# EAGLE design mainboard (EAGLE 9.6.2)
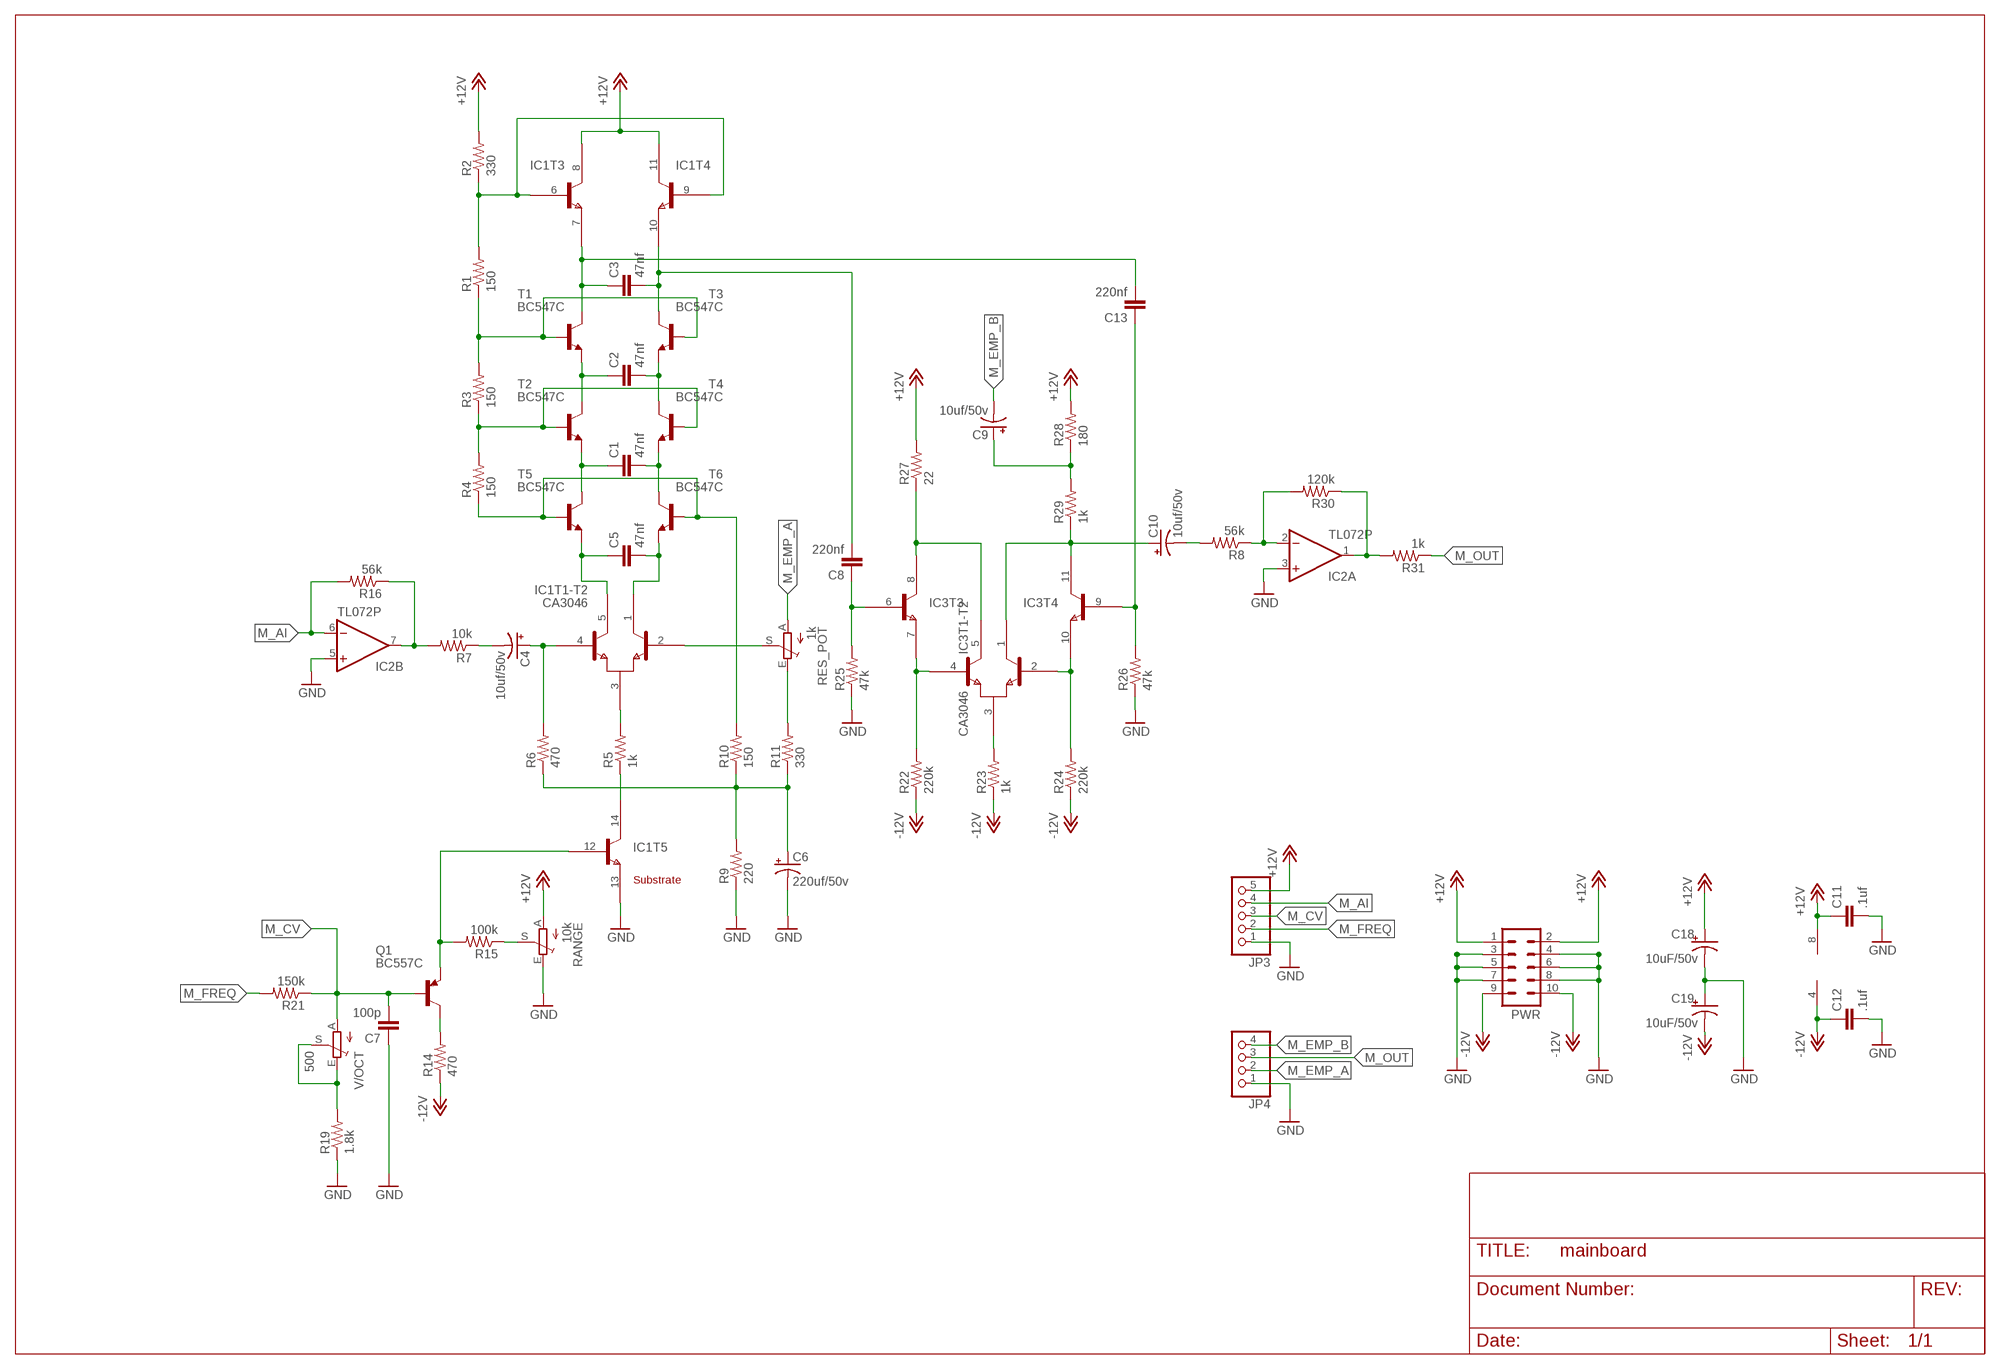
[diagram p0: schematic, sheet 1]

## Parts
C1  47nf  C-EU050-024X044  [C050-024X044]
C2  47nf  C-EU050-024X044  [C050-024X044]
C3  47nf  C-EU050-024X044  [C050-024X044]
C4  10uf/50v  CPOL-USE2.5-5  [E2,5-5]
C5  47nf  C-EU050-024X044  [C050-024X044]
C6  220uf/50v  CPOL-USE3.5-10  [E3,5-10]
C7  100p  C-EU050-024X044  [C050-024X044]
C8  220nf  C-EU050-024X044  [C050-024X044]
C9  10uf/50v  CPOL-USE2.5-5  [E2,5-5]
C10  10uf/50v  CPOL-USE2.5-5  [E2,5-5]
C11  .1uf  C-EU050-024X044  [C050-024X044]
C12  .1uf  C-EU050-024X044  [C050-024X044]
C13  220nf  C-EU050-024X044  [C050-024X044]
C18  10uF/50v  CPOL-USE2.5-6  [E2,5-6]
C19  10uF/50v  CPOL-USE2.5-6  [E2,5-6]
IC1  CA3046  [DIL14]
IC2  TL072P  [DIL08]
IC3  CA3046  [DIL14]
JP3  PINHD-1X5  [1X05]
JP4  PINHD-1X4  [1X04]
PWR  ML10  [ML10]
Q1  BC557C  [TO92-EBC]
R1  150  R-US_0204/7  [0204/7]
R2  330  R-US_0204/7  [0204/7]
R3  150  R-US_0204/7  [0204/7]
R4  150  R-US_0204/7  [0204/7]
R5  1k  R-US_0204/7  [0204/7]
R6  470  R-US_0204/7  [0204/7]
R7  10k  R-US_0204/7  [0204/7]
R8  56k  R-US_0204/7  [0204/7]
R9  220  R-US_0204/7  [0204/7]
R10  150  R-US_0204/7  [0204/7]
R11  330  R-US_0204/7  [0204/7]
R14  470  R-US_0204/7  [0204/7]
R15  100k  R-US_0204/7  [0204/7]
R16  56k  R-US_0204/7  [0204/7]
R19  1.8k  R-US_0204/7  [0204/7]
R21  150k  R-US_0204/7  [0204/7]
R22  220k  R-US_0204/7  [0204/7]
R23  1k  R-US_0204/7  [0204/7]
R24  220k  R-US_0204/7  [0204/7]
R25  47k  R-US_0204/7  [0204/7]
R26  47k  R-US_0204/7  [0204/7]
R27  22  R-US_0204/7  [0204/7]
R28  180  R-US_0204/7  [0204/7]
R29  1k  R-US_0204/7  [0204/7]
R30  120k  R-US_0204/7  [0204/7]
R31  1k  R-US_0204/7  [0204/7]
RANGE  10k  TRIM_EU-CA9V  [CA9V]
RES_POT  1k  TRIM_EU-CA9V  [CA9V]
T1  BC547C  BC547-NPN-TO92-CBE  [TO92-CBE]
T2  BC547C  BC547-NPN-TO92-CBE  [TO92-CBE]
T3  BC547C  BC547-NPN-TO92-CBE  [TO92-CBE]
T4  BC547C  BC547-NPN-TO92-CBE  [TO92-CBE]
T5  BC547C  BC547-NPN-TO92-CBE  [TO92-CBE]
T6  BC547C  BC547-NPN-TO92-CBE  [TO92-CBE]
V/OCT  500  TRIM_1234-S64YW  [S64YW]

## Nets
+12V: C11.1 C18.+ IC1.8(T3:C) IC1.11(T4:C) IC2.8(P:V+) JP3.5 PWR.1 PWR.2 R2.2 R27.2 R28.2 RANGE.A
-12V: C12.1 C19.- IC2.4(P:V-) PWR.9 PWR.10 R14.1 R22.1 R23.1 R24.1
GND: C6.- C7.1 C11.2 C12.2 C18.- C19.+ IC1.13(T5:E) IC2.3(A:+IN) IC2.5(B:+IN) JP3.1 JP4.1 PWR.3 PWR.4 PWR.5 PWR.6 PWR.7 PWR.8 R9.1 R19.1 R25.1 R26.1 RANGE.E
M_AI: IC2.6(B:-IN) JP3.4 R16.2
M_CV: C7.2 JP3.3 Q1.B R21.1 V/OCT.A
M_EMP_A: JP4.2 RES_POT.A
M_EMP_B: C9.- JP4.4
M_FREQ: JP3.2 R21.2
M_OUT: JP4.3 R31.1
N$1: C5.1 IC1.5(T1-T2:C2) T5.E
N$2: IC1.6(T3:B) IC1.9(T4:B) R1.2 R2.1
N$3: C3.1 C13.2 IC1.7(T3:E) T1.C
N$4: C3.2 C8.2 IC1.10(T4:E) T3.C
N$5: C2.1 T1.E T2.C
N$6: C2.2 T3.E T4.C
N$7: C1.1 T2.E T5.C
N$8: C1.2 T4.E T6.C
N$9: R1.1 R3.2 T1.B T3.B
N$10: R3.1 R4.2 T2.B T4.B
N$11: R4.1 R10.2 T5.B T6.B
N$12: C5.2 IC1.1(T1-T2:C1) T6.E
N$13: IC1.3(T1-T2:E) R5.2
N$14: IC1.14(T5:C) R5.1
N$15: C4.+ IC1.4(T1-T2:B2) R6.2
N$16: C4.- R7.1
N$17: C6.+ R6.1 R9.2 R10.1 R11.1
N$18: IC2.7(B:OUT) R7.2 R16.1
N$19: R19.2 V/OCT.E V/OCT.S
N$20: IC1.12(T5:B) Q1.E R15.2
N$21: IC1.2(T1-T2:B1) RES_POT.S
N$22: R11.2 RES_POT.E
N$23: C13.1 IC3.9(T4:B) R26.2
N$25: Q1.C R14.2
N$26: R15.1 RANGE.S
N$32: C10.- R8.2
N$34: IC3.4(T1-T2:B2) IC3.7(T3:E) R22.2
N$35: IC3.3(T1-T2:E) R23.2
N$36: IC3.2(T1-T2:B1) IC3.10(T4:E) R24.2
N$38: IC3.5(T1-T2:C2) IC3.8(T3:C) R27.1
N$39: C10.+ IC3.1(T1-T2:C1) IC3.11(T4:C) R29.1
N$40: C9.+ R28.1 R29.2
N$41: IC2.1(A:OUT) R30.1 R31.2
N$42: C8.1 IC3.6(T3:B) R25.2
N$43: IC2.2(A:-IN) R8.1 R30.2
Unconnected: IC3.12(T5:B) IC3.13(T5:E) IC3.14(T5:C) V/OCT.S@1(S)

## Library data of the parts
C1-C3 C5 C7 C8 C11-C13 = resistor:C-EU: CAPACITOR, European symbol
C4 C6 C9 C10 C18 C19 = resistor:CPOL-US: POLARIZED CAPACITOR, American symbol
IC1 IC3 = synthdiy:CA3046: NPN Transistor Array
IC2 = TomW:TL072: OP AMP
JP3 = pinhead:PINHD-1X5: PIN HEADER
JP4 = pinhead:PINHD-1X4: PIN HEADER
PWR = con-ml:ML10: HARTING; OC_FARNELL: unknown; OC_NEWARK: unknown
Q1 = transistor-pnp:BC557*: PNP Transistror
R1-R11 R14-R16 R19 R21-R31 = resistor:R-US_: RESISTOR, American symbol
RANGE RES_POT = pot:TRIM_EU-: POTENTIOMETER
T1-T6 = transistor:*-NPN-: NPN Transistror BF959 corrected 2008.03.06
V/OCT = pot:TRIM_1234-: POTENTIOMETER

## Board
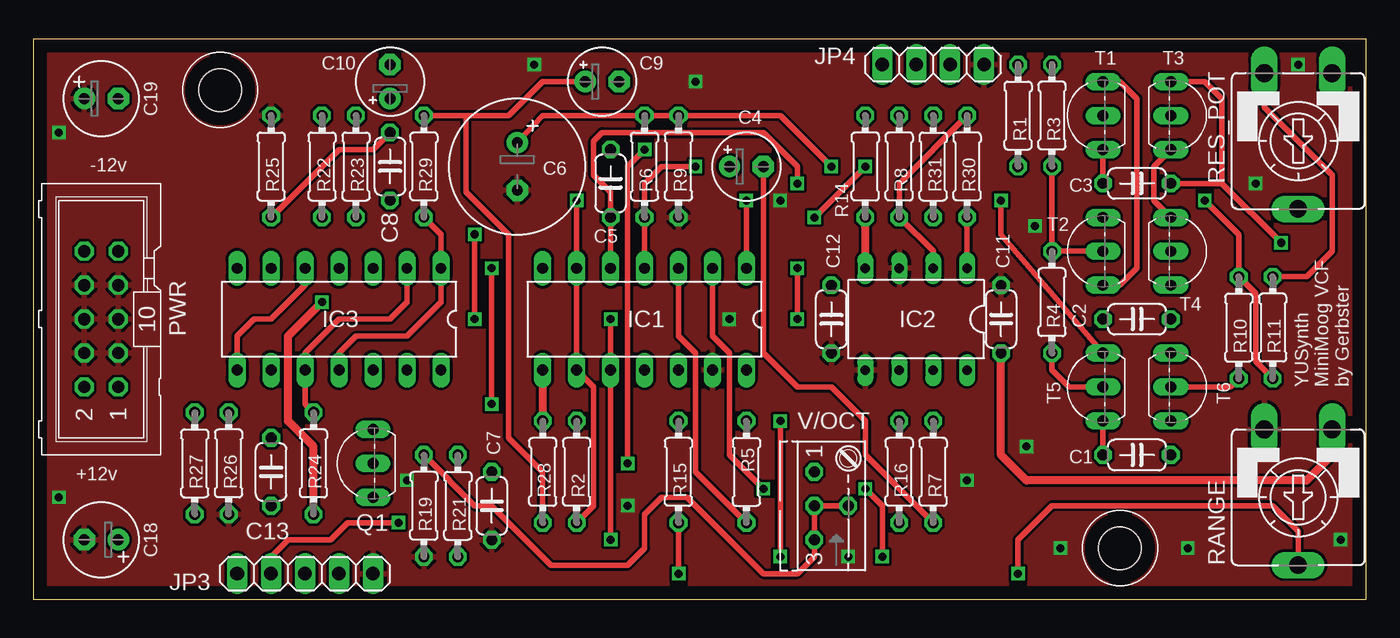
[diagram p1: board, top side]
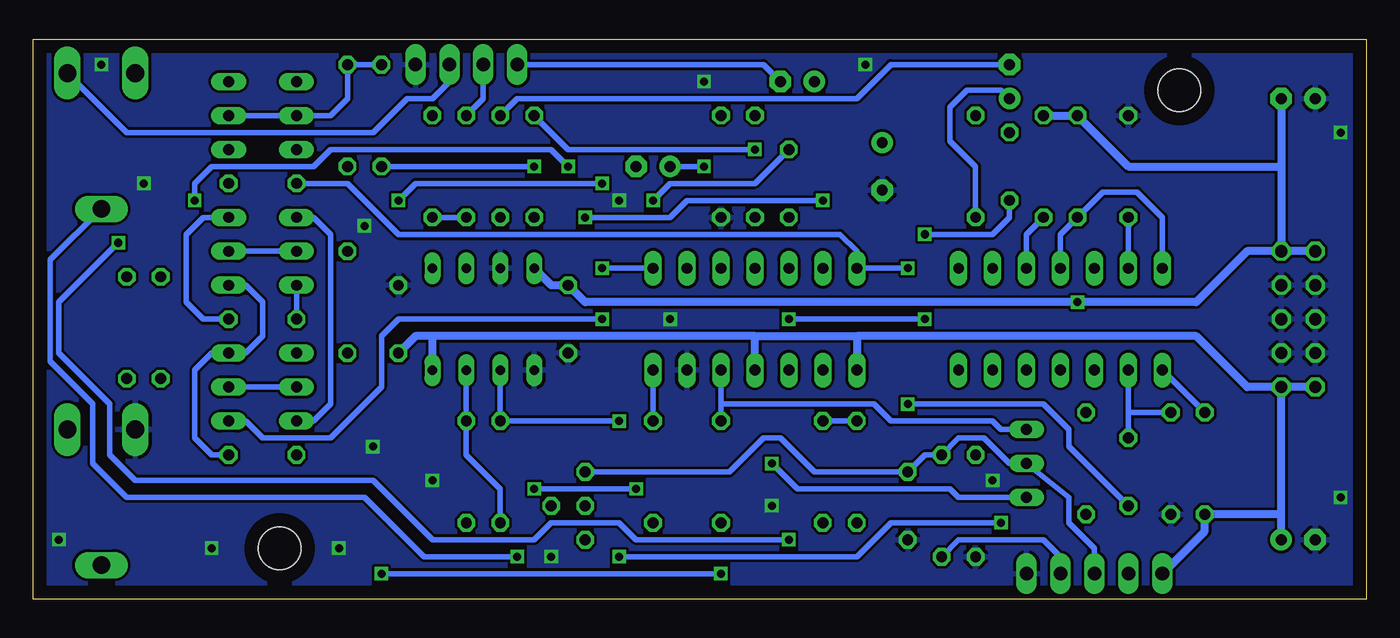
[diagram p2: board, bottom side, seen from below]

Size 99.69 x 41.91 mm. Coordinates in mm from the lower left corner, seen from the top.
Outline: 99.69,41.91 2.54,41.91 1.91,41.91 0,41.91 0,0 99.69,0 99.69,41.91
Copper layers (1*16): Top 0.035mm / dielectric 1.5mm / Bottom 0.035mm
Design rules "default": minimum track width 10mil, minimum drill 24mil, track to track 8mil, track to pad 8mil, pad to pad 8mil, via to via 8mil, smd to smd 8mil, copper to edge 40mil, drill to drill 8mil, minimum pad ring 10mil, minimum via ring 8mil, stop-mask expansion 4mil, vias tented up to drill 0mil, thermal gap 10mil
Holes 3.2 mm at 13.97,38.1 81.28,3.81

### Footprints (pad centres in the part's own frame; a part is rotated, then mirrored left to right if it is on the bottom)
C050-024X044 = drill 0.813 octagon: 1 -2.54,0; 2 2.54,0
E2,5-5 = drill 0.813 pad 1.6: + -1.27,0 | drill 0.813 pad 1.6 octagon: - 1.27,0
E3,5-10 = drill 0.813 pad 1.6: + -1.778,0 | drill 0.813 pad 1.6 octagon: - 1.778,0
E2,5-6 = drill 0.813 pad 1.6: + -1.27,0 | drill 0.813 pad 1.6 octagon: - 1.27,0
DIL14 = drill 0.813 long: 1 -7.62,-3.81; 2 -5.08,-3.81; 3 -2.54,-3.81; 4 0,-3.81; 5 2.54,-3.81; 6 5.08,-3.81; 7 7.62,-3.81; 8 7.62,3.81; 9 5.08,3.81; 10 2.54,3.81; 11 0,3.81; 12 -2.54,3.81; 13 -5.08,3.81; 14 -7.62,3.81
DIL08 = drill 0.7 long: 1 -3.81,-3.81; 2 -1.27,-3.81; 3 1.27,-3.81; 4 3.81,-3.81; 5 3.81,3.81; 6 1.27,3.81; 7 -1.27,3.81; 8 -3.81,3.81
1X05 = drill 1.016 long: 1 -5.08,0; 2 -2.54,0; 3 0,0; 4 2.54,0; 5 5.08,0
1X04 = drill 1.016 long: 1 -3.81,0; 2 -1.27,0; 3 1.27,0; 4 3.81,0
ML10 = drill 0.914 octagon: 1 -5.08,-1.27; 2 -5.08,1.27; 3 -2.54,-1.27; 4 -2.54,1.27; 5 0,-1.27; 6 0,1.27; 7 2.54,-1.27; 8 2.54,1.27; 9 5.08,-1.27; 10 5.08,1.27
TO92-EBC = drill 0.813 long: B 0,-1.27; C -2.54,-1.27; E 2.54,-1.27
0204/7 = drill 0.813 octagon: 1 -3.81,0; 2 3.81,0
CA9V = drill 1.321 long: A -2.54,-5.08; E 2.54,-5.08; S 0,5.08
TO92-CBE = drill 0.813 long: B 0,0; C -2.54,0; E 2.54,0
S64YW = drill 0.813 octagon: A 2.54,1.27; E -2.54,1.27; S 0,-1.27; S@1 0,1.27

### Placement (x,y rotation side)
C1  82.55,10.79 0 top
C2  82.55,20.95 0 top
C3  82.55,31.11 0 top
C4  53.34,32.38 0 top
C5  43.18,31.11 90 top
C6  36.2,32.38 270 top
C7  34.29,6.99 90 top
C8  26.67,32.38 270 top
C9  42.55,38.73 0 top
C10  26.67,38.73 90 top
C11  72.39,20.95 90 top
C12  59.69,20.95 270 top
C13  17.78,9.53 270 top
C18  5.08,4.45 180 top
C19  5.08,37.47 0 top
IC1  45.72,20.95 180 top
IC2  66.04,20.95 180 top
IC3  22.86,20.95 180 top
JP3  20.32,1.91 180 top
JP4  67.31,40.01 180 top
PWR  5.08,20.95 90 top
Q1  24.13,10.16 90 top
R1  73.66,36.2 270 top
R2  40.64,9.53 90 top
R3  76.2,36.2 90 top
R4  76.2,22.23 90 top
R5  53.34,9.53 270 top
R6  45.72,32.38 270 top
R7  67.31,9.53 90 top
R8  64.77,32.38 90 top
R9  48.26,32.38 90 top
R10  90.17,20.32 270 top
R11  92.71,20.32 90 top
R14  62.23,32.38 90 top
R15  48.26,9.53 90 top
R16  64.77,9.53 90 top
R19  29.21,6.99 90 top
R21  31.75,6.99 270 top
R22  21.59,32.38 270 top
R23  24.13,32.38 270 top
R24  20.95,10.16 90 top
R25  17.78,32.38 270 top
R26  14.61,10.16 90 top
R27  12.06,10.16 270 top
R28  38.1,9.53 90 top
R29  29.21,32.38 90 top
R30  69.85,32.38 90 top
R31  67.31,32.38 270 top
RANGE  94.61,7.62 180 top
RES_POT  94.61,34.29 180 top
T1  80.01,36.2 90 top
T2  80.01,26.04 90 top
T3  85.09,36.2 270 top
T4  85.09,26.04 270 top
T5  80.01,15.88 90 top
T6  85.09,15.88 270 top
V/OCT  59.69,6.99 90 top

### Tracks (layer width: path | path; a pad name or v marks a point on that pad's centre or on a via)
+12V
  Top 0.61: IC1.8 R28.2 | RANGE.A 97.16,10.79 95.25,8.89 74.3,8.89 72.39,10.79 C11.1
  Bottom 0.406: R28.2 R2.2
  Bottom 0.61: PWR.2 PWR.1 | PWR.1 C18.+ 6.35,6.35 R27.2 12.06,5.08 JP3.5 | PWR.1 8.89,15.88 12.7,19.68 38.1,19.68 | 38.1,19.68 IC1.8 | 45.72,19.68 38.1,19.68 | IC1.11 45.72,19.68 | 45.72,19.68 69.85,19.68 | IC2.8 69.85,19.68 | 69.85,19.68 71.12,19.68 C11.1
-12V  (via drill 0.6)
  Top 0.61: IC2.4 R14.1 | R24.1 20.95,11.43 19.05,13.34 19.05,19.68 v21.59,22.23
  Bottom 0.61: PWR.10 PWR.9 | PWR.9 8.89,26.04 12.7,22.23 v21.59,22.23 58.42,22.23 C12.1 60.96,23.5 IC2.4 | R23.1 R22.1 17.78,32.38 6.35,32.38 | C19.- 6.35,32.38 | 6.35,32.38 PWR.9
GND  (via drill 0.6)
  other vias: 86.36,3.81 91.44,31.11 52.07,20.95 55.88,29.84 37.47,40.01 60.96,3.17 44.45,6.99 27.94,8.89 1.91,34.92 1.91,7.62 49.53,38.73 97.79,4.45 74.3,11.43 74.93,27.94 94.61,40.01 69.85,8.89 76.83,3.81
  pour Top: 0,41.91 0,0 99.69,0 99.69,41.91
  pour Bottom: 0,41.91 0,0 99.69,0 99.69,41.91
M_AI  (via drill 0.6)
  Top 0.406: v55.88,3.17 v55.88,13.34 | JP3.4 17.78,3.17 19.05,4.45 22.23,4.45 23.5,5.71 v27.3,5.71
  Bottom 0.406: IC2.6 R16.2 v55.88,13.34 | v27.3,5.71 35.56,5.71 38.1,3.17 v55.88,3.17
M_CV
  Bottom 0.406: V/OCT.A 47.62,9.53 45.09,12.06 43.81,12.06 41.27,9.53 C7.2 33.02,10.79 R21.1 30.48,12.06 28.57,12.06 26.67,10.16 Q1.B 22.23,7.62 22.23,5.71 20.32,3.81 JP3.3
M_EMP_A
  Bottom 0.406: JP4.2 68.58,38.73 69.85,37.47 71.75,37.47 74.3,34.92 92.71,34.92 RES_POT.A
M_EMP_B
  Bottom 0.406: JP4.4 45.09,40.01 C9.-
M_FREQ
  Bottom 0.406: R21.2 30.48,4.45 24.13,4.45 22.86,3.17 JP3.2
M_OUT
  Bottom 0.406: JP4.3 66.04,37.47 R31.1
N$1  (via drill 0.6)
  Top 0.406: IC1.5 C5.1 43.18,30.48 41.91,31.75 41.91,34.29 42.55,34.92 54.61,34.92 57.15,32.38 v57.15,31.11 | v72.39,29.84 72.39,27.3 T5.E
  Bottom 0.406: v57.15,31.11 71.12,31.11 v72.39,29.84
N$2  (via drill 0.6)
  Top 0.406: R2.1 41.91,6.99 41.91,15.88 IC1.9 IC1.6 v40.64,29.84 | v62.23,32.38 v58.42,28.57
  Bottom 0.406: R1.2 v62.23,32.38 | v58.42,28.57 52.07,28.57 50.8,29.84 v40.64,29.84
N$3  (via drill 0.6)
  Top 0.406: T1.C C3.1 | v34.29,14.61 v34.29,24.77
  Bottom 0.406: v34.29,14.61 24.13,14.61 22.23,12.7 22.23,11.43 C13.2 | v34.29,24.77 IC1.7 38.1,26.04 39.37,27.3 72.39,27.3 76.2,31.11 C3.1
N$4  (via drill 0.6)
  Top 0.406: T3.C 87.63,38.73 88.9,37.47 88.9,31.11 | 88.9,31.11 C3.2 | v33.02,27.3 v33.02,20.95 | v43.18,20.95 IC1.10 v43.18,4.45 | v93.34,26.67 88.9,31.11
  Bottom 0.406: C8.2 26.67,28.57 27.94,27.3 v33.02,27.3 | v33.02,20.95 v43.18,20.95 | v43.18,4.45 54.61,4.45 55.88,5.71 60.96,5.71 62.23,4.45 69.85,4.45 74.3,8.89 92.08,8.89 93.98,10.79 93.98,14.61 97.79,18.41 97.79,22.23 v93.34,26.67
N$5
  Top 0.406: T1.E 81.28,38.73 82.55,37.47 82.55,24.77 81.28,23.5 T2.C
  Bottom 0.406: C2.1 T2.C
N$6
  Top 0.406: T3.E 83.82,32.38 83.82,29.84 T4.C
  Bottom 0.406: T4.C 87,28.57 88.27,27.3 88.27,22.23 87,20.95 C2.2
N$7
  Top 0.406: T5.C C1.1
  Bottom 0.406: T2.E 78.74,28.57 77.47,27.3 77.47,14.61 78.74,13.34 T5.C
N$8
  Bottom 0.406: C1.2 86.36,10.79 87.63,12.06 87.63,17.14 86.36,18.41 T6.C 83.82,18.41 82.55,19.68 82.55,22.23 83.82,23.5 T4.E
N$9
  Bottom 0.406: T3.B T1.B 77.47,36.2 76.2,37.47 R3.2 R1.1
N$10
  Top 0.406: T2.B R4.2 R3.1
  Bottom 0.406: T4.B T2.B
N$11
  Top 0.406: T5.B 77.47,15.88 76.2,17.14 R4.1 | T6.B 89.53,15.88 R10.2
  Bottom 0.406: T5.B T6.B
N$12  (via drill 0.6)
  Top 0.406: IC1.1 v53.34,29.84 | v57.15,24.77 v57.15,20.95
  Bottom 0.406: v53.34,29.84 52.07,31.11 45.72,31.11 C5.2 | IC1.1 v57.15,24.77 | v57.15,20.95 72.39,20.95 73.66,19.68 73.66,15.88 77.47,12.06 82.55,12.06 83.82,13.34 T6.E
N$13
  Top 0.406: IC1.3 48.26,19.68 49.53,18.41 49.53,9.53 R5.2
N$14
  Bottom 0.406: IC1.14 R5.1
N$15  (via drill 0.6)
  Top 0.406: IC1.4 R6.2 45.72,31.11 46.99,32.38 v49.53,32.38
  Bottom 0.406: C4.+ v49.53,32.38
N$16
  Top 0.406: C4.- 54.61,18.41 57.15,15.88 59.69,15.88 62.23,13.34 62.23,10.79 R7.1
N$17  (via drill 0.6)
  Top 0.406: R6.1 R9.2 | R11.1 91.44,17.78 91.44,22.86 R10.1 90.17,27.3 v87.63,29.84 | R9.2 38.1,36.2 C6.+ | v59.69,32.38 55.88,36.2 R9.2
  Bottom 0.406: v59.69,32.38 60.96,33.66 77.47,33.66 78.74,32.38 86.36,32.38 87.63,31.11 v87.63,29.84
N$18
  Bottom 0.406: IC2.7 R7.2 67.31,10.79 64.77,8.26 R16.1
N$19
  Top 0.406: R19.2 33.02,6.99 34.29,6.99 38.73,2.54 44.45,2.54 45.72,3.81 45.72,6.35 46.99,7.62 48.9,7.62 54.61,1.91 57.15,1.91 58.42,3.17 V/OCT.E 58.42,6.99 V/OCT.S
N$20
  Bottom 0.406: Q1.E 27.3,12.7 27.94,13.34 35.56,13.34 36.83,14.61 48.26,14.61 R15.2 IC1.12
N$21  (via drill 0.6)
  Top 0.406: IC1.2 50.8,19.68 52.07,18.41 52.07,10.79 v54.61,8.26 | v62.23,8.26 63.5,6.99 v63.5,3.17
  Bottom 0.406: v54.61,8.26 v62.23,8.26 | v63.5,3.17 70.48,3.17 74.93,7.62 92.71,7.62 95.25,10.16 95.25,14.61 98.42,17.78 98.42,25.4 RES_POT.S
N$22
  Top 0.406: RES_POT.E 92.08,36.83 97.16,31.75 97.16,26.04 95.25,24.13 R11.2
N$23
  Bottom 0.406: 17.78,13.97 C13.1 | IC3.9 17.78,13.97 | 17.78,13.97 R26.2
N$25  (via drill 0.6)
  Top 0.406: v45.72,33.66 44.45,32.38 v44.45,10.16
  Bottom 0.406: R14.2 59.69,33.66 v45.72,33.66 | v44.45,10.16 42.55,8.26 31.11,8.26 30.48,7.62 Q1.C
N$26  (via drill 0.6)
  Top 0.406: R15.1 v48.26,1.91 | RANGE.S 94.61,5.08 92.71,6.99 76.2,6.99 73.66,4.45 v73.66,1.91
  Bottom 0.406: v48.26,1.91 v73.66,1.91
N$32
  Bottom 0.406: R8.2 63.5,37.47 38.1,37.47 35.56,40.01 C10.-
N$34
  Bottom 0.406: IC3.4 22.86,27.3 R22.2 19.68,30.48 17.14,30.48 15.24,28.57 IC3.7
N$35
  Bottom 0.406: IC3.3 25.4,27.3 R23.2
N$36
  Top 0.406: R24.2 20.32,14.61 IC3.10 20.32,18.41 22.86,20.95 26.67,20.95 27.94,22.23 IC3.2
N$38
  Top 0.406: IC3.8 15.24,19.68 16.51,20.95 17.78,20.95 20.32,23.5 IC3.5
  Bottom 0.406: R27.1 IC3.8
N$39
  Top 0.406: R29.1 30.48,27.3 IC3.1 30.48,22.23 27.94,19.68 24.13,19.68 22.86,18.41 IC3.11
  Bottom 0.406: C10.+ 27.3,38.1 29.84,38.1 31.11,36.83 31.11,34.29 29.21,32.38 R29.1
N$40
  Top 0.406: R28.1 38.1,9.53 35.56,12.06 35.56,27.3 32.38,30.48 32.38,36.2 | C9.+ 38.1,38.73 35.56,36.2 32.38,36.2 | 32.38,36.2 R29.2
N$41
  Top 0.406: R30.1 IC2.1
  Bottom 0.406: R30.1 R31.2
N$42
  Top 0.406: R25.2 22.86,33.66 25.4,33.66 C8.1
  Bottom 0.406: IC3.6 R25.2
N$43
  Top 0.406: IC2.2 67.31,26.04 R8.1 64.77,31.11 R30.2

### Text on the board
tNames: -12v | YUSynth / MiniMoog VCF / by Gerbster | +12v